# EAGLE design ledstringpower_unrouted (EAGLE 9.2.2)
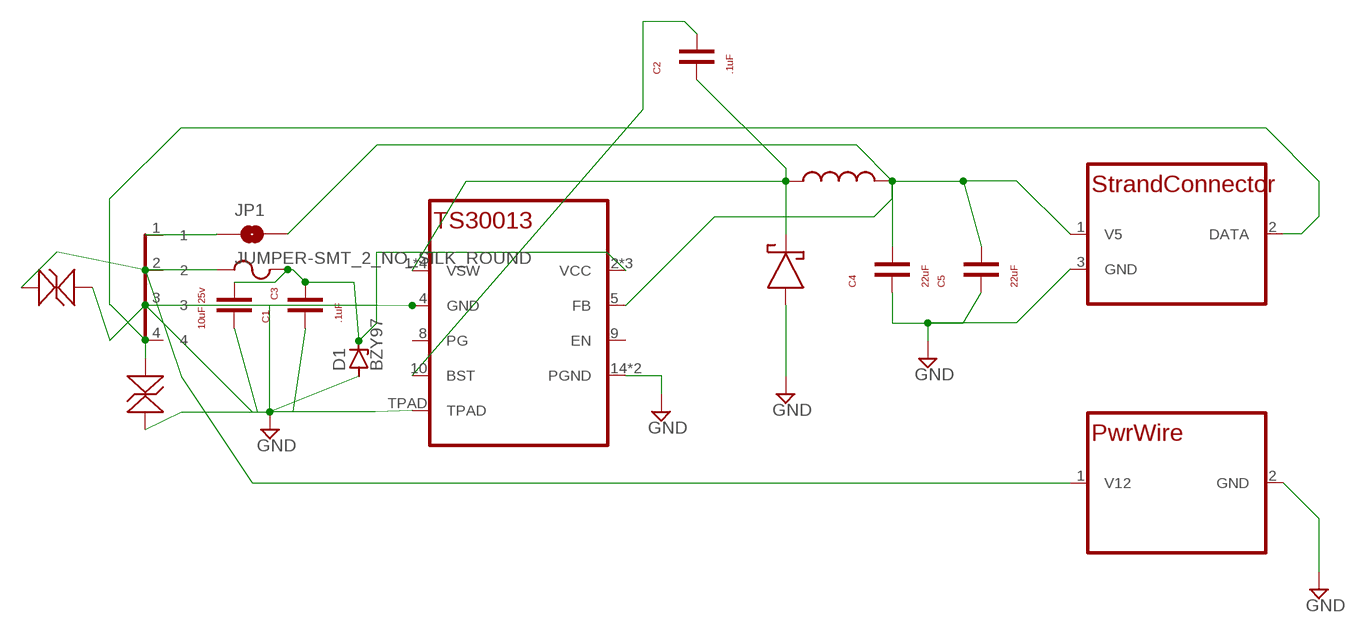
[diagram p0: schematic, sheet 1]

## Parts
C1  .1uF  CAPACITOR_NONPOLARC0603  [C0603]
C2  .1uF  CAPACITOR_NONPOLARC0603  [C0603]
C3  10uF 25v  CL31A106MAHNNNEC1206  [C1206]
C4  22uF  GRM188R61A226ME15DC0603  [C0603]
C5  22uF  GRM188R61A226ME15DC0603  [C0603]
D1  BZY97  [F126Z12]
D2  LS54LS54  [LS54]
F1  3A  FUSER0603  [R0603]
IC1  TS30013QFN16  [QFN16]
JP1  JUMPER-SMT_2_NO_SILK_ROUND  [SMT-JUMPER_2_NO_SILK_ROUND]
L1  SRN5040TA-4R7MSRN5040TA  [SRN5040TA]
TVS1  DESD5V0U1BL-7BDFN1006-2  [DFN1006-2]
TVS2  DESD5V0U1BL-7BDFN1006-2  [DFN1006-2]
U$3  TE-1969806-1TE-1969806-1  [TE-1969806-1]
U$5  LEDSTRANDDLEDWIREP  [LEDWIREP]
U$8  PWRWIREDPWRWIREP  [PWRWIREP]

## Nets
DATA: TVS2.2 U$3.4 U$5.2(DATA)
GND: C1.1 C3.2 C4.1 C5.1 D1.A D2.1 IC1.4(GND) IC1.14(PGND) IC1.15(PGND) IC1.TPAD TVS1.1 TVS2.1 U$3.3 U$5.3(GND) U$8.2(GND)
N$3: C2.1 D2.2 IC1.1(VSW) IC1.12(VSW) IC1.13(VSW) IC1.16(VSW) L1.1
N$5: C2.2 IC1.10(BST)
N$7: JP1.1 U$3.1
V5: C4.2 C5.2 IC1.5(FB) JP1.2 L1.2 U$5.1(V5)
V12: F1.1 TVS1.2 U$3.2 U$8.1(V12)
VCC: C1.2 C3.1 D1.C F1.2 IC1.2(VCC) IC1.3(VCC) IC1.11(VCC)
Unconnected: IC1.8(PG) IC1.9(EN)

## Library data of the parts
C1 C2 = ledinlinesupply:CAPACITOR_NONPOLAR
C3 = ledinlinesupply:CL31A106MAHNNNE
C4 C5 = ledinlinesupply:GRM188R61A226ME15D
D1 = diode:BZY97: Z DIODE
D2 = ledinlinesupply:LS54
F1 = ledinlinesupply:FUSE
IC1 = ledinlinesupply:TS30013
JP1 = SparkFun-Jumpers:JUMPER-SMT_2_NO: Normally open jumper This jumper has two pads in close proximity to each other. Apply solder to close the connection. Round pads are easier to solder for beginners, but are a lot larger. SparkFun Product that uses the round pads: SparkFun EL Sequencer <https://www.sparkfun.com/products/12781>
L1 = ledinlinesupply:SRN5040TA-4R7M
TVS1 TVS2 = ledinlinesupply:DESD5V0U1BL-7B
U$3 = ledinlinesupply:TE-1969806-1
U$5 = ledinlinesupply:LEDSTRANDD
U$8 = ledinlinesupply:PWRWIRED

## Board
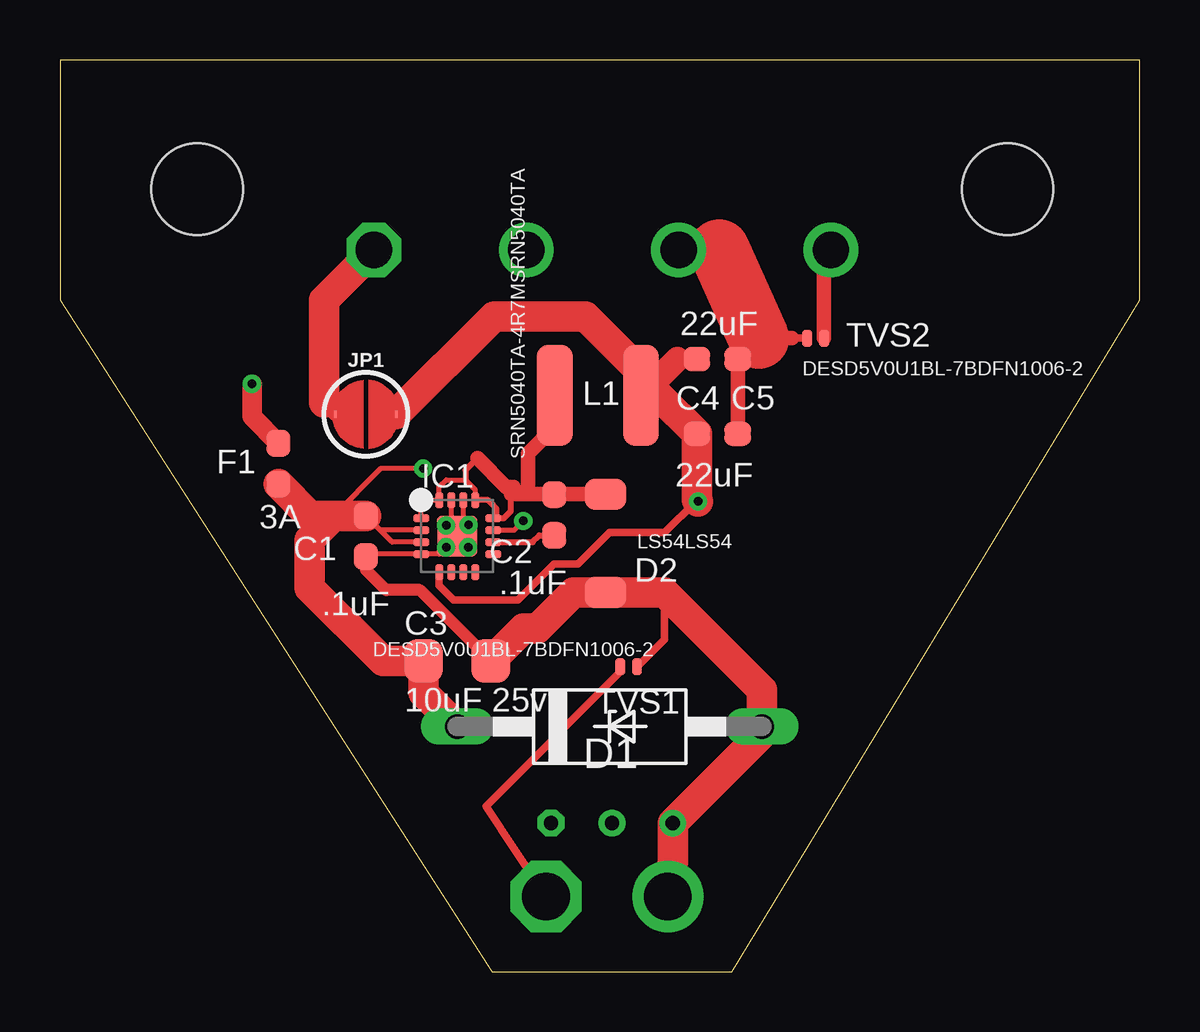
[diagram p1: board, top side]
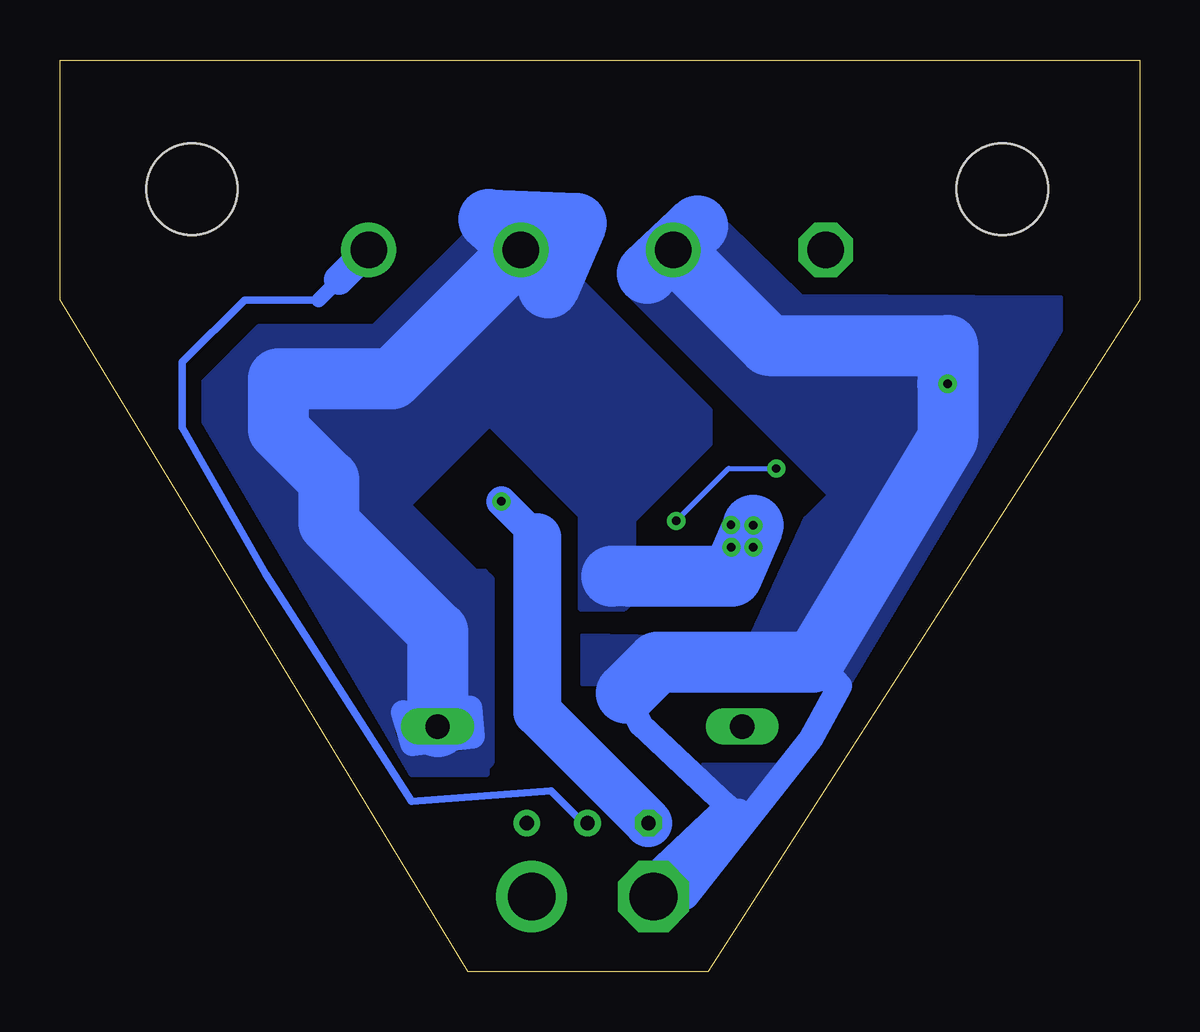
[diagram p2: board, bottom side, seen from below]

Size 45 x 38 mm. Coordinates in mm from the lower left corner, seen from the top.
Outline: 18,0 28,0 45,28 45,38 0,38 0,28 18,0
Copper layers (1*16): Top 0.035mm / dielectric 1.5mm / Bottom 0.035mm
Design rules "default": minimum track width 6mil, minimum drill 0.35mm, track to track 6mil, track to pad 6mil, pad to pad 6mil, via to via 6mil, smd to smd 6mil, copper to edge 40mil, drill to drill 6mil, minimum pad ring 10mil, minimum via ring 8mil, stop-mask expansion 4mil, vias tented up to drill 0mil, thermal gap 10mil

### Footprints (pad centres in the part's own frame; a part is rotated, then mirrored left to right if it is on the bottom)
C0603 = smd 1.1 x 1: 1 -0.85,0; 2 0.85,0
C1206 = smd 1.6 x 1.8: 1 -1.4,0; 2 1.4,0
F126Z12 = drill 1.016 long: A 6.35,0; C -6.35,0
LS54 = smd 1.3 x 1.75: 1 -2.05,0; 2 2.05,0
R0603 = smd 1.1 x 1: 1 -0.85,0; 2 0.85,0
QFN16 = smd 0.65 x 0.34: 1 -1.5,0.75; 2 -1.5,0.25; 3 -1.5,-0.25; 4 -1.5,-0.75; 9 1.5,-0.75; 10 1.5,-0.25; 11 1.5,0.25; 12 1.5,0.75 | smd 0.34 x 0.65: 5 -0.75,-1.5; 6 -0.25,-1.5; 7 0.25,-1.5; 8 0.75,-1.5; 13 0.75,1.5; 14 0.25,1.5; 15 -0.25,1.5; 16 -0.75,1.5 | smd 1.7 x 1.7: TPAD 0,0
SMT-JUMPER_2_NO_SILK_ROUND = smd 0.152 x 0.305: 1 -1.27,0; 2 1.27,0
SRN5040TA = smd 1.5 x 4.2: 1 -1.8,0; 2 1.8,0
DFN1006-2 = smd 0.4 x 0.7: 1 -0.35,0; 2 0.35,0
TE-1969806-1 = drill 1.52 octagon: 1 -9.525,0 | drill 1.52: 2 -3.175,0; 3 3.175,0; 4 9.525,0 | hole 3.81: -16.89,2.54; 16.89,2.54
LEDWIREP = drill 0.6 octagon: 1 -2.54,0 | drill 0.6: 2 0,0; 3 2.54,0
PWRWIREP = drill 1.981 octagon: 1 -2.54,0 | drill 1.981: 2 2.54,0

### Placement (x,y rotation side)
C1  12.75,18.15 90 top
C2  20.6,19.03 270 top
C3  16.56,12.94 0 top
C4  27.4,22.42 180 top
C5  27.4,25.53 180 top
D1  22.91,10.21 0 top
D2  22.74,17.85 90 top
F1  9.11,21.17 270 top
IC1  16.56,18.15 0 top
JP1  12.75,23.23 0 top
L1  22.42,24.02 0 top
TVS1  23.7,12.7 180 top
TVS2  31.5,26.4 0 top
U$3  22.61,30.08 0 top
U$5  23.01,6.19 0 top
U$8  22.8,3.12 0 top

### Tracks (layer width: path | path; a pad name or v marks a point on that pad's centre or on a via)
DATA
  Top 0.305: 31.85,29.8 U$3.4
  Top 0.61: TVS2.2 31.85,29.8
  Bottom 0.305: U$5.2 23.2,6.19 24.54,7.52 30.34,7.1 36.44,16.56 39.9,22.68 39.9,25.4 37.3,28 34.22,28
  Bottom 0.61: 34.22,28 33.36,28.85
  Bottom 1.27: 33.36,28.85 U$3.4
GND  (via drill 0.35)
  Top 0.2: IC1.14 16.81,18.84 v17.03,18.62 | v17.03,18.62 16.81,18.6 16.8,18.6 16.56,18.36 IC1.TPAD | IC1.15 16.31,18.81 v16.1,18.6 16.3,18.41 IC1.TPAD | C1.1 12.85,17.4 IC1.4 15.81,17.4 v17.02,17.69 IC1.TPAD | IC1.TPAD v17.03,18.62 | IC1.TPAD v16.1,17.69
  Top 0.305: 25.2,15.8 25.2,13.85 TVS1.1 | TVS2.1 30.5,26.4
  Top 0.508: C3.2 15,15.9 13.6,15.9 12.75,16.75 C1.1
  Top 0.61: C4.1 C5.1 29.12,26.4 30.5,26.4
  Top 1.27: U$8.2 25.55,4.6 U$5.3 29.26,9.9 D1.A 29.26,11.74 25.2,15.8 D2.1 21.4,15.8 19.9,14.3 19.32,14.3 C3.2 | U$3.3 27.47,30.08
  Top 2.54: 27.47,30.08 29.12,26.4
  Bottom 0.61: v17.02,17.69 17.01,16.47
  Bottom 1.016: D1.A 30.7,10.8 30.3,9.5 27.8,9.8 27.9,11
  Bottom 2.54: D1.A 29.26,14.16 33.8,18.7 33.8,20.5 35.9,22.6 35.9,24.7 31.16,24.7 U$3.3 27.12,31.35 23.47,31.19 24.64,28.49 | v16.1,18.6 17.01,16.47 21.28,16.47 21.99,16.48
  pour Bottom: 25.2,30.7 17.9,23.4 17.9,22 21.1,18.8 21.1,15.5 21.5,15.1 23.3,15.1 23.3,19 27.1,22.8 30.4,19.5 30.4,19.4 27.7,16.7 27.3,16.7 27,16.4 27,8.7 27.2,8.5 27.2,8.2 30.34,8.2 39,22.89 39,24.6 36.7,26.9 31.9,26.9 27,31.8 26.4,31.8 24.8,30.2
N$3
  Top 0.2: IC1.1 15.06,19.36 15.35,19.65 IC1.16 15.81,20.21 16.1,20.5 16.9,20.5 17.31,20.09 IC1.13 | 18.6,20.2 18.8,20 | 18.8,20 18.8,19.9 | 18.06,19.44 18.2,19.3 18.2,18.9 | 18.8,20 18.92,19.88 19.52,19.88
  Top 0.254: 17.4,21.4 16.9,20.9 16.9,20.5 | IC1.12 18.2,18.9 18.5,18.9 18.8,19.2 18.8,19.9 | 18.8,20.1 18.9,20.2 | IC1.13 17.85,19.65 18.06,19.44
  Top 0.406: 19.5,19.9 19.52,19.88 C2.1
  Top 0.61: D2.2 19.5,19.9 | 19.5,19.9 18.8,19.9 | 18.9,20.2 18.6,20.2 17.4,21.4 | 19.5,19.9 19.5,21.6 20.62,22.72 L1.1
N$5
  Top 0.254: C2.2 19.98,18.18 19.7,17.9 IC1.10
N$7
  Top 0.61: 11,23.71 JP1.1
  Top 1.27: U$3.1 11,27.99 11,23.71
V5  (via drill 0.35)
  Top 0.305: IC1.5 15.81,16.09 16.4,15.5 19.1,15.5 20.6,17 21.6,17 22.9,18.3 25.2,18.3 26.5,19.6 v26.6,19.6
  Top 0.61: 24.22,24.98 L1.2 24.95,24.02 | 25.73,25.53 C5.2
  Top 1.016: L1.2 25.73,25.53
  Top 1.27: JP1.2 18.09,27.3 21.9,27.3 24.22,24.98 | 24.95,24.02 C4.2 26.55,19.65 v26.6,19.6
  Bottom 1.27: 25.1,18.1 v26.6,19.6
  Bottom 2: U$5.1 25.1,10.82 25.1,18.1
V12  (via drill 0.35)
  Top 0.305: TVS1.2 23.35,12.48 17.76,6.89 U$8.1
  Top 0.813: F1.1 8,23.13 v8,24.5
  Bottom 1.016: 13.52,13.03 12.5,11.9 13.7,9.7 18.9,3.1 19.3,3.1 | 19.3,3.1 U$8.1 | 21.4,11.6 20.8,10.3 17.2,6.9 20.6,3.7 20.11,3.48 16.7,6.7 19.3,3.1
  Bottom 2.54: 21.4,11.6 20.1,12.9 13.6,12.9 13.52,13.03 8,22.23 v8,24.5 8,26.1 15.45,26.1 U$3.2 18.42,31.09 20.53,29.11
  pour Bottom: 19.48,30.16 21.38,28.28 12.97,19.87 13.92,18.93 13.92,18.93 16.24,13.91 23.24,14.04 23.24,11.96 12.09,11.96 3.26,26.75 3.26,28.11 14.1,28.17 17.14,31.15 19.51,30.2
  pour Bottom: 16.2,6.8 14.9,8.6 18.2,8.6 16.7,6.7
VCC  (via drill 0.35)
  Top 0.2: 13.35,18.4 13.85,17.9 IC1.3 | 13.35,18.4 C1.2 | v19.31,18.78 18.93,18.4 IC1.11 | v15.14,20.97 13.37,20.97 11.4,19 | IC1.2 13.35,18.4
  Top 1.27: D1.C 15.16,11.61 C3.1 13.46,12.94 10.4,16 10.4,18 11.4,19 | 11.4,19 C1.2 | 11.4,19 10.43,19 F1.2
  Bottom 0.2: v19.31,18.78 17.13,20.97 v15.14,20.97